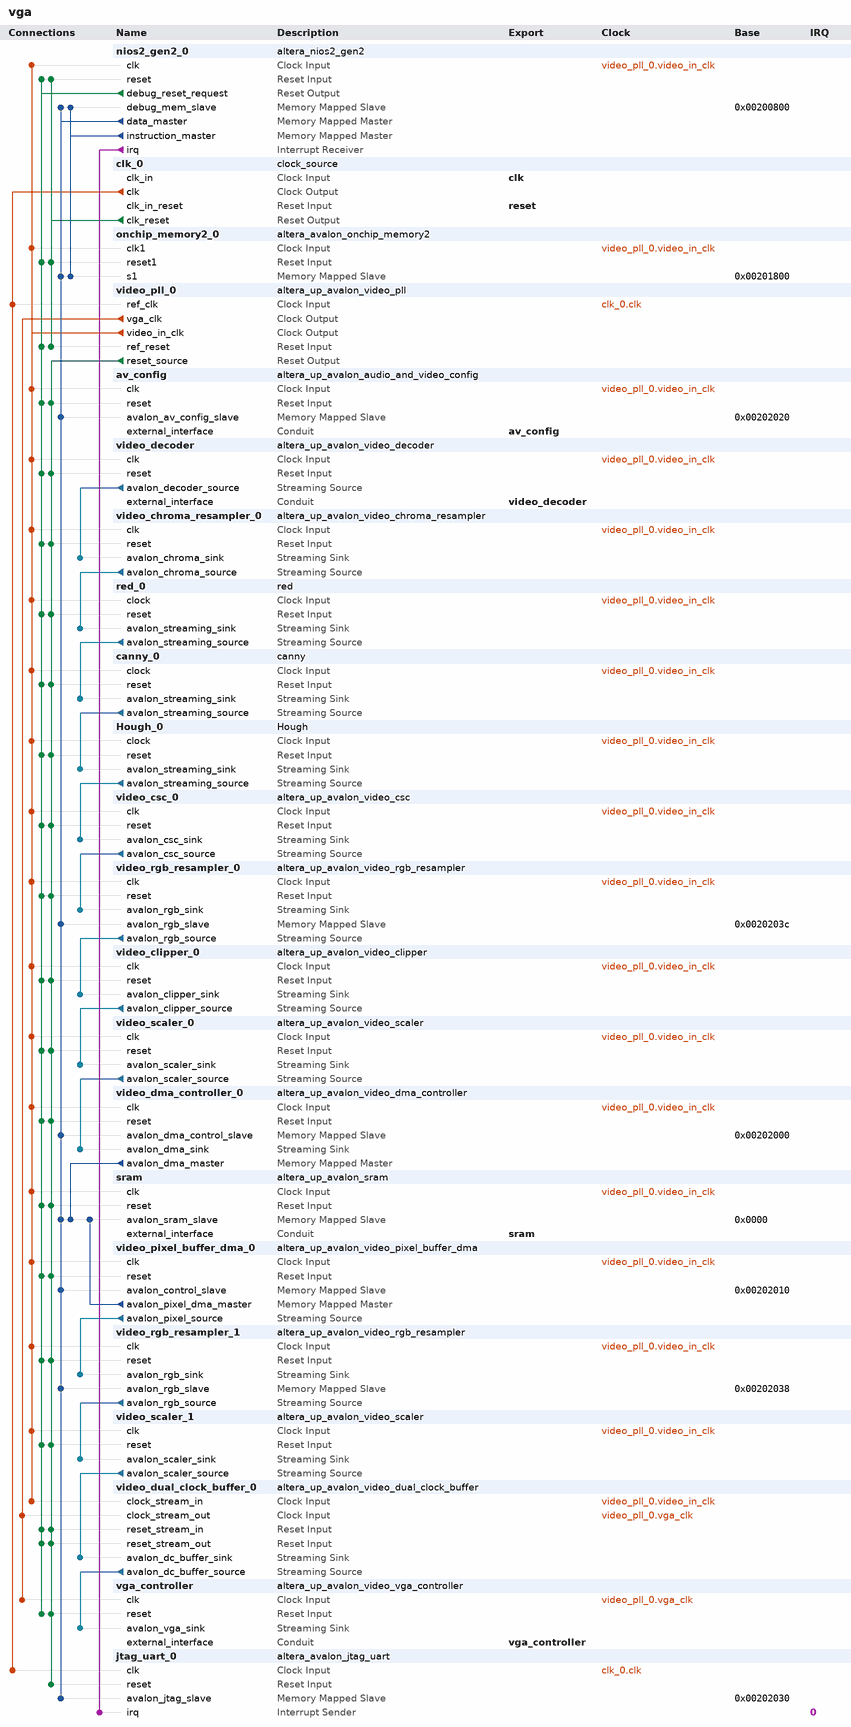
[diagram p0: system contents]
# Platform Designer (Qsys) system vga, Cyclone IV E EP4CE115F29C7
# Parameters at their usual value, and those the tool derives, are not listed.
package require -exact qsys 18.0
create_system vga
set_project_property DEVICE_FAMILY {Cyclone IV E}
set_project_property DEVICE EP4CE115F29C7

add_instance nios2_gen2_0 altera_nios2_gen2 23.1
set_instance_parameter_value nios2_gen2_0 dcache_size 2048
set_instance_parameter_value nios2_gen2_0 exceptionSlave onchip_memory2_0.s1
set_instance_parameter_value nios2_gen2_0 icache_size 4096
set_instance_parameter_value nios2_gen2_0 impl Tiny
set_instance_parameter_value nios2_gen2_0 resetSlave onchip_memory2_0.s1

add_instance clk_0 clock_source 23.1
set_instance_parameter_value clk_0 clockFrequency 50000000

add_instance onchip_memory2_0 altera_avalon_onchip_memory2 23.1
set_instance_parameter_value onchip_memory2_0 dataWidth 32
set_instance_parameter_value onchip_memory2_0 dualPort false
set_instance_parameter_value onchip_memory2_0 initMemContent true
set_instance_parameter_value onchip_memory2_0 initializationFileName onchip_mem.hex
set_instance_parameter_value onchip_memory2_0 memorySize 1960

add_instance video_pll_0 altera_up_avalon_video_pll 18.0
set_instance_parameter_value video_pll_0 camera {5MP Digital Camera (THDB_D5M)}
set_instance_parameter_value video_pll_0 gui_refclk 50.0
set_instance_parameter_value video_pll_0 lcd {7" LCD on VEEK-MT and MTL/MTL2 Modules}
set_instance_parameter_value video_pll_0 video_in_clk_en true

add_instance av_config altera_up_avalon_audio_and_video_config 18.0
set_instance_parameter_value av_config audio_in {Microphone to ADC}
set_instance_parameter_value av_config bit_length 24
set_instance_parameter_value av_config board DE2-115
set_instance_parameter_value av_config line_in_bypass false
set_instance_parameter_value av_config sampling_rate {48 kHz}

add_instance video_decoder altera_up_avalon_video_decoder 18.0

add_instance video_chroma_resampler_0 altera_up_avalon_video_chroma_resampler 18.0

add_instance red_0 red 1.0

add_instance canny_0 canny 1.0

add_instance Hough_0 Hough 1.0

add_instance video_csc_0 altera_up_avalon_video_csc 18.0

add_instance video_rgb_resampler_0 altera_up_avalon_video_rgb_resampler 18.0
set_instance_parameter_value video_rgb_resampler_0 alpha 1023
set_instance_parameter_value video_rgb_resampler_0 input_type {24-bit RGB}
set_instance_parameter_value video_rgb_resampler_0 output_type {16-bit RGB}

add_instance video_clipper_0 altera_up_avalon_video_clipper 18.0
set_instance_parameter_value video_clipper_0 color_bits 16
set_instance_parameter_value video_clipper_0 color_planes 1

add_instance video_scaler_0 altera_up_avalon_video_scaler 18.0
set_instance_parameter_value video_scaler_0 color_bits 16
set_instance_parameter_value video_scaler_0 color_planes 1
set_instance_parameter_value video_scaler_0 height_scaling 1
set_instance_parameter_value video_scaler_0 width_in 640
set_instance_parameter_value video_scaler_0 width_scaling 0.5

add_instance video_dma_controller_0 altera_up_avalon_video_dma_controller 18.0
set_instance_parameter_value video_dma_controller_0 addr_mode X-Y
set_instance_parameter_value video_dma_controller_0 back_start_address 0
set_instance_parameter_value video_dma_controller_0 color_bits 16
set_instance_parameter_value video_dma_controller_0 color_planes 1
set_instance_parameter_value video_dma_controller_0 dma_enabled true
set_instance_parameter_value video_dma_controller_0 height 240
set_instance_parameter_value video_dma_controller_0 mode {From Stream to Memory}
set_instance_parameter_value video_dma_controller_0 start_address 0
set_instance_parameter_value video_dma_controller_0 width 320

add_instance sram altera_up_avalon_sram 18.0
set_instance_parameter_value sram board DE2-115
set_instance_parameter_value sram pixel_buffer true

add_instance video_pixel_buffer_dma_0 altera_up_avalon_video_pixel_buffer_dma 18.0
set_instance_parameter_value video_pixel_buffer_dma_0 addr_mode X-Y
set_instance_parameter_value video_pixel_buffer_dma_0 back_start_address 0
set_instance_parameter_value video_pixel_buffer_dma_0 color_space {16-bit RGB}
set_instance_parameter_value video_pixel_buffer_dma_0 image_height 240
set_instance_parameter_value video_pixel_buffer_dma_0 image_width 320
set_instance_parameter_value video_pixel_buffer_dma_0 start_address 0

add_instance video_rgb_resampler_1 altera_up_avalon_video_rgb_resampler 18.0
set_instance_parameter_value video_rgb_resampler_1 alpha 1023
set_instance_parameter_value video_rgb_resampler_1 input_type {16-bit RGB}
set_instance_parameter_value video_rgb_resampler_1 output_type {30-bit RGB}

add_instance video_scaler_1 altera_up_avalon_video_scaler 18.0
set_instance_parameter_value video_scaler_1 color_bits 10
set_instance_parameter_value video_scaler_1 color_planes 3
set_instance_parameter_value video_scaler_1 height_scaling 2
set_instance_parameter_value video_scaler_1 width_in 320
set_instance_parameter_value video_scaler_1 width_scaling 2

add_instance video_dual_clock_buffer_0 altera_up_avalon_video_dual_clock_buffer 18.0
set_instance_parameter_value video_dual_clock_buffer_0 color_bits 10

add_instance vga_controller altera_up_avalon_video_vga_controller 18.0
set_instance_parameter_value vga_controller board DE2-115
set_instance_parameter_value vga_controller resolution {VGA 640x480}

add_instance jtag_uart_0 altera_avalon_jtag_uart 23.1
set_instance_parameter_value jtag_uart_0 simInteractiveOptions NO_INTERACTIVE_WINDOWS

# connections
add_connection clk_0.clk jtag_uart_0.clk clock
add_connection clk_0.clk video_pll_0.ref_clk clock
add_connection video_pll_0.vga_clk vga_controller.clk clock
add_connection video_pll_0.vga_clk video_dual_clock_buffer_0.clock_stream_out clock
add_connection video_pll_0.video_in_clk av_config.clk clock
add_connection video_pll_0.video_in_clk canny_0.clock clock
add_connection video_pll_0.video_in_clk Hough_0.clock clock
add_connection video_pll_0.video_in_clk nios2_gen2_0.clk clock
add_connection video_pll_0.video_in_clk onchip_memory2_0.clk1 clock
add_connection video_pll_0.video_in_clk red_0.clock clock
add_connection video_pll_0.video_in_clk sram.clk clock
add_connection video_pll_0.video_in_clk video_chroma_resampler_0.clk clock
add_connection video_pll_0.video_in_clk video_clipper_0.clk clock
add_connection video_pll_0.video_in_clk video_csc_0.clk clock
add_connection video_pll_0.video_in_clk video_decoder.clk clock
add_connection video_pll_0.video_in_clk video_dma_controller_0.clk clock
add_connection video_pll_0.video_in_clk video_dual_clock_buffer_0.clock_stream_in clock
add_connection video_pll_0.video_in_clk video_pixel_buffer_dma_0.clk clock
add_connection video_pll_0.video_in_clk video_rgb_resampler_0.clk clock
add_connection video_pll_0.video_in_clk video_rgb_resampler_1.clk clock
add_connection video_pll_0.video_in_clk video_scaler_0.clk clock
add_connection video_pll_0.video_in_clk video_scaler_1.clk clock
add_connection clk_0.clk_reset nios2_gen2_0.reset reset
add_connection clk_0.clk_reset onchip_memory2_0.reset1 reset
add_connection clk_0.clk_reset video_pll_0.ref_reset reset
add_connection nios2_gen2_0.debug_reset_request av_config.reset reset
add_connection nios2_gen2_0.debug_reset_request canny_0.reset reset
add_connection nios2_gen2_0.debug_reset_request Hough_0.reset reset
add_connection nios2_gen2_0.debug_reset_request nios2_gen2_0.reset reset
add_connection nios2_gen2_0.debug_reset_request onchip_memory2_0.reset1 reset
add_connection nios2_gen2_0.debug_reset_request red_0.reset reset
add_connection nios2_gen2_0.debug_reset_request sram.reset reset
add_connection nios2_gen2_0.debug_reset_request vga_controller.reset reset
add_connection nios2_gen2_0.debug_reset_request video_chroma_resampler_0.reset reset
add_connection nios2_gen2_0.debug_reset_request video_clipper_0.reset reset
add_connection nios2_gen2_0.debug_reset_request video_csc_0.reset reset
add_connection nios2_gen2_0.debug_reset_request video_decoder.reset reset
add_connection nios2_gen2_0.debug_reset_request video_dma_controller_0.reset reset
add_connection nios2_gen2_0.debug_reset_request video_dual_clock_buffer_0.reset_stream_in reset
add_connection nios2_gen2_0.debug_reset_request video_dual_clock_buffer_0.reset_stream_out reset
add_connection nios2_gen2_0.debug_reset_request video_pixel_buffer_dma_0.reset reset
add_connection nios2_gen2_0.debug_reset_request video_pll_0.ref_reset reset
add_connection nios2_gen2_0.debug_reset_request video_rgb_resampler_0.reset reset
add_connection nios2_gen2_0.debug_reset_request video_rgb_resampler_1.reset reset
add_connection nios2_gen2_0.debug_reset_request video_scaler_0.reset reset
add_connection nios2_gen2_0.debug_reset_request video_scaler_1.reset reset
add_connection video_pll_0.reset_source av_config.reset reset
add_connection video_pll_0.reset_source canny_0.reset reset
add_connection video_pll_0.reset_source Hough_0.reset reset
add_connection video_pll_0.reset_source jtag_uart_0.reset reset
add_connection video_pll_0.reset_source red_0.reset reset
add_connection video_pll_0.reset_source sram.reset reset
add_connection video_pll_0.reset_source vga_controller.reset reset
add_connection video_pll_0.reset_source video_chroma_resampler_0.reset reset
add_connection video_pll_0.reset_source video_clipper_0.reset reset
add_connection video_pll_0.reset_source video_csc_0.reset reset
add_connection video_pll_0.reset_source video_decoder.reset reset
add_connection video_pll_0.reset_source video_dma_controller_0.reset reset
add_connection video_pll_0.reset_source video_dual_clock_buffer_0.reset_stream_in reset
add_connection video_pll_0.reset_source video_dual_clock_buffer_0.reset_stream_out reset
add_connection video_pll_0.reset_source video_pixel_buffer_dma_0.reset reset
add_connection video_pll_0.reset_source video_rgb_resampler_0.reset reset
add_connection video_pll_0.reset_source video_rgb_resampler_1.reset reset
add_connection video_pll_0.reset_source video_scaler_0.reset reset
add_connection video_pll_0.reset_source video_scaler_1.reset reset
add_connection nios2_gen2_0.data_master av_config.avalon_av_config_slave avalon
set_connection_parameter_value nios2_gen2_0.data_master/av_config.avalon_av_config_slave baseAddress 0x00202020
add_connection nios2_gen2_0.data_master jtag_uart_0.avalon_jtag_slave avalon
set_connection_parameter_value nios2_gen2_0.data_master/jtag_uart_0.avalon_jtag_slave baseAddress 0x00202030
add_connection nios2_gen2_0.data_master nios2_gen2_0.debug_mem_slave avalon
set_connection_parameter_value nios2_gen2_0.data_master/nios2_gen2_0.debug_mem_slave baseAddress 0x00200800
add_connection nios2_gen2_0.data_master onchip_memory2_0.s1 avalon
set_connection_parameter_value nios2_gen2_0.data_master/onchip_memory2_0.s1 baseAddress 0x00201800
add_connection nios2_gen2_0.data_master sram.avalon_sram_slave avalon
set_connection_parameter_value nios2_gen2_0.data_master/sram.avalon_sram_slave baseAddress 0x0000
add_connection nios2_gen2_0.data_master video_dma_controller_0.avalon_dma_control_slave avalon
set_connection_parameter_value nios2_gen2_0.data_master/video_dma_controller_0.avalon_dma_control_slave baseAddress 0x00202000
add_connection nios2_gen2_0.data_master video_pixel_buffer_dma_0.avalon_control_slave avalon
set_connection_parameter_value nios2_gen2_0.data_master/video_pixel_buffer_dma_0.avalon_control_slave baseAddress 0x00202010
add_connection nios2_gen2_0.data_master video_rgb_resampler_0.avalon_rgb_slave avalon
set_connection_parameter_value nios2_gen2_0.data_master/video_rgb_resampler_0.avalon_rgb_slave baseAddress 0x0020203c
add_connection nios2_gen2_0.data_master video_rgb_resampler_1.avalon_rgb_slave avalon
set_connection_parameter_value nios2_gen2_0.data_master/video_rgb_resampler_1.avalon_rgb_slave baseAddress 0x00202038
add_connection nios2_gen2_0.instruction_master nios2_gen2_0.debug_mem_slave avalon
set_connection_parameter_value nios2_gen2_0.instruction_master/nios2_gen2_0.debug_mem_slave baseAddress 0x00200800
add_connection nios2_gen2_0.instruction_master onchip_memory2_0.s1 avalon
set_connection_parameter_value nios2_gen2_0.instruction_master/onchip_memory2_0.s1 baseAddress 0x00201800
add_connection video_dma_controller_0.avalon_dma_master sram.avalon_sram_slave avalon
set_connection_parameter_value video_dma_controller_0.avalon_dma_master/sram.avalon_sram_slave baseAddress 0x0000
add_connection video_pixel_buffer_dma_0.avalon_pixel_dma_master sram.avalon_sram_slave avalon
set_connection_parameter_value video_pixel_buffer_dma_0.avalon_pixel_dma_master/sram.avalon_sram_slave baseAddress 0x0000
add_connection canny_0.avalon_streaming_source Hough_0.avalon_streaming_sink avalon_streaming
add_connection Hough_0.avalon_streaming_source video_csc_0.avalon_csc_sink avalon_streaming
add_connection red_0.avalon_streaming_source canny_0.avalon_streaming_sink avalon_streaming
add_connection video_chroma_resampler_0.avalon_chroma_source red_0.avalon_streaming_sink avalon_streaming
add_connection video_clipper_0.avalon_clipper_source video_scaler_0.avalon_scaler_sink avalon_streaming
add_connection video_csc_0.avalon_csc_source video_rgb_resampler_0.avalon_rgb_sink avalon_streaming
add_connection video_decoder.avalon_decoder_source video_chroma_resampler_0.avalon_chroma_sink avalon_streaming
add_connection video_dual_clock_buffer_0.avalon_dc_buffer_source vga_controller.avalon_vga_sink avalon_streaming
add_connection video_pixel_buffer_dma_0.avalon_pixel_source video_rgb_resampler_1.avalon_rgb_sink avalon_streaming
add_connection video_rgb_resampler_0.avalon_rgb_source video_clipper_0.avalon_clipper_sink avalon_streaming
add_connection video_rgb_resampler_1.avalon_rgb_source video_scaler_1.avalon_scaler_sink avalon_streaming
add_connection video_scaler_0.avalon_scaler_source video_dma_controller_0.avalon_dma_sink avalon_streaming
add_connection video_scaler_1.avalon_scaler_source video_dual_clock_buffer_0.avalon_dc_buffer_sink avalon_streaming
add_connection nios2_gen2_0.irq jtag_uart_0.irq interrupt
set_connection_parameter_value nios2_gen2_0.irq/jtag_uart_0.irq irqNumber 0

# exported interfaces
add_interface av_config conduit end
set_interface_property av_config EXPORT_OF av_config.external_interface
add_interface clk clock sink
set_interface_property clk EXPORT_OF clk_0.clk_in
add_interface reset reset sink
set_interface_property reset EXPORT_OF clk_0.clk_in_reset
add_interface sram conduit end
set_interface_property sram EXPORT_OF sram.external_interface
add_interface vga_controller conduit end
set_interface_property vga_controller EXPORT_OF vga_controller.external_interface
add_interface video_decoder conduit end
set_interface_property video_decoder EXPORT_OF video_decoder.external_interface

set_interconnect_requirement {$system} qsys_mm.clockCrossingAdapter HANDSHAKE
set_interconnect_requirement {$system} qsys_mm.enableEccProtection FALSE
set_interconnect_requirement {$system} qsys_mm.insertDefaultSlave FALSE
set_interconnect_requirement {$system} qsys_mm.maxAdditionalLatency 1

save_system vga.qsys
